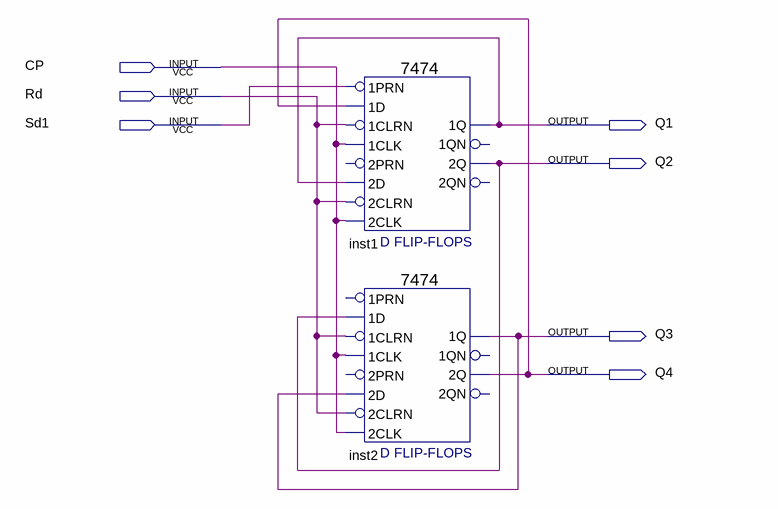
[diagram p0: schematic sheet]
// Quartus schematic pj703.bdf as structural Verilog: 2 symbols, 7 pins
module pj703 (
  input  CP,
  input  Rd,
  input  Sd1,
  output Q1,
  output Q2,
  output Q3,
  output Q4
);

  \7474  inst1 (
    .\2D (Q1), .\1CLK (CP), .\1D (Q4), .\1PRN (Sd1), .\2CLK (CP), .\2CLRN (Rd), .\1CLRN (Rd), .\2Q (Q2),
    .\1Q (Q1));  // open: 2PRN, 1QN, 2QN
  \7474  inst2 (
    .\2D (Q3), .\1CLK (CP), .\1D (Q2), .\2CLK (CP), .\2CLRN (Rd), .\1CLRN (Rd), .\2Q (Q4), .\1Q (Q3));  // open: 2PRN, 1PRN, 1QN, 2QN
endmodule
